# Altium schematic sheet Top.SchDoc
size Tabloid
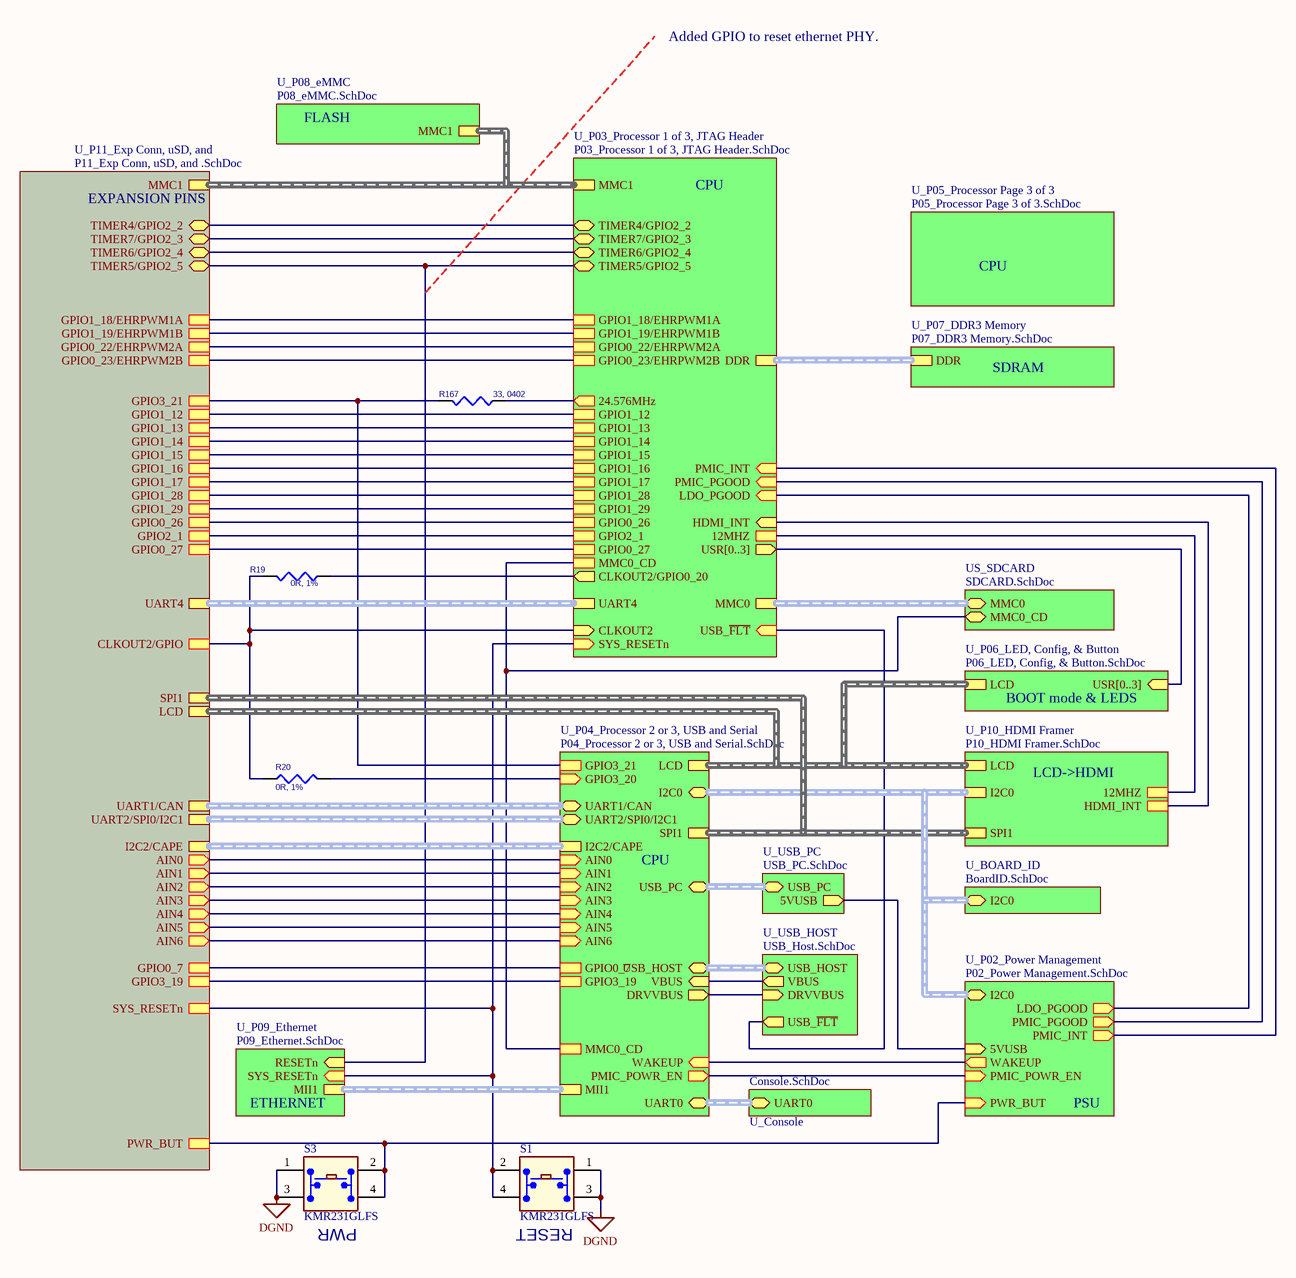
[diagram p0: Top.SchDoc]

## Parts
R19  0R, 1%  [402]
R20  0R, 1%  [402]
R167  33, 0402  [402]
S1  KMR231GLFS  [SW4SMD_63X161LS]
S3  KMR231GLFS  [SW4SMD_63X161LS]

## Sub-sheets
Console.SchDoc = U_Console: UART0 (harness UART)
U_BOARD_ID = BoardID.SchDoc: I2C0 (harness I2C)
U_P02_Power Management = P02_Power Management.SchDoc: PMIC_PGOOD (out), LDO_PGOOD (out), WAKEUP (out), PMIC_INT (out), PMIC_POWR_EN (in), PWR_BUT (in), I2C0 (harness I2C), 5VUSB (in)
U_P03_Processor 1 of 3, JTAG Header = P03_Processor 1 of 3, JTAG Header.SchDoc: GPIO2_1, GPIO1_29, GPIO1_28, GPIO0_22/EHRPWM2A, GPIO0_23/EHRPWM2B, GPIO0_26, GPIO0_27, GPIO1_12, GPIO1_13, GPIO1_14, GPIO1_15, GPIO1_17, GPIO1_18/EHRPWM1A, GPIO1_19/EHRPWM1B, USB_~{FLT} (in), SYS_RESETn (in), PMIC_INT (in), 12MHZ, GPIO1_16, 24.576MHz (out), LDO_PGOOD (in), PMIC_PGOOD (in), MMC0_CD, HDMI_INT (in), USR[0..3] (out), MMC1 (harness MMC1), MMC0 (harness MMC0), UART4 (harness UART), DDR (harness DDR), CLKOUT2/GPIO0_20 (out), CLKOUT2 (in), TIMER5/GPIO2_5 (bidir), TIMER4/GPIO2_2 (bidir), TIMER7/GPIO2_3 (bidir), TIMER6/GPIO2_4 (bidir)
U_P04_Processor 2 or 3, USB and Serial = P04_Processor 2 or 3, USB and Serial.SchDoc: GPIO3_21, GPIO3_19, GPIO3_20 (in), PMIC_POWR_EN (out), WAKEUP (in), AIN0 (in), AIN1 (in), AIN2 (in), AIN3 (in), AIN4 (in), AIN5 (in), AIN6 (in), MMC0_CD, GPIO0_7, LCD (harness LCD), SPI1 (harness SPI), I2C2/CAPE (harness I2C), MII1 (harness MII), I2C0 (harness I2C), UART0 (harness UART), UART1/CAN (harness UART/CAN), UART2/SPI0/I2C1 (harness UART/SPI/I2C1), USB_PC (harness USB_PC), USB_HOST (harness USB_PC), VBUS (in), DRVVBUS (out)
U_P05_Processor Page 3 of 3 = P05_Processor Page 3 of 3.SchDoc: no entries
U_P06_LED, Config, & Button = P06_LED, Config, & Button.SchDoc: USR[0..3] (in), LCD (harness LCD)
U_P07_DDR3 Memory = P07_DDR3 Memory.SchDoc: DDR (harness DDR)
U_P08_eMMC = P08_eMMC.SchDoc: MMC1 (harness MMC1)
U_P09_Ethernet = P09_Ethernet.SchDoc: MII1 (harness MII), RESETn (in), SYS_RESETn (in)
U_P10_HDMI Framer = P10_HDMI Framer.SchDoc: HDMI_INT, 12MHZ, I2C0 (harness I2C), LCD (harness LCD), SPI1 (harness SPI)
U_P11_Exp Conn, uSD, and = P11_Exp Conn, uSD, and .SchDoc: GPIO1_13, GPIO0_23/EHRPWM2B, GPIO1_15, GPIO0_27, GPIO0_22/EHRPWM2A, GPIO1_12, GPIO0_26, GPIO1_14, GPIO2_1, GPIO1_29, PWR_BUT, GPIO1_16, GPIO1_17, GPIO3_21, GPIO3_19, AIN4 (out), AIN6 (out), AIN2 (out), AIN0 (out), CLKOUT2/GPIO, SYS_RESETn, GPIO1_28, GPIO1_18/EHRPWM1A, GPIO1_19/EHRPWM1B, AIN5 (out), AIN3 (out), AIN1 (out), GPIO0_7, LCD (harness LCD), MMC1 (harness MMC1), UART4 (harness UART), I2C2/CAPE (harness I2C), UART2/SPI0/I2C1 (harness UART/SPI/I2C1), UART1/CAN (harness UART/CAN), SPI1 (harness SPI), TIMER5/GPIO2_5 (bidir), TIMER7/GPIO2_3 (bidir), TIMER6/GPIO2_4 (bidir), TIMER4/GPIO2_2 (bidir)
U_USB_HOST = USB_Host.SchDoc: USB_HOST (harness USB_PC), USB_~{FLT} (out), VBUS (out), DRVVBUS (in)
U_USB_PC = USB_PC.SchDoc: USB_PC (harness USB_PC), 5VUSB (out)
US_SDCARD = SDCARD.SchDoc: MMC0 (harness MMC0), MMC0_CD

## Nets
DGND: S1.1(A1) S1.3(A3) S3.1(A1) S3.3(A3)
NetR19_1: R19.1 ; sheet U_P03_Processor 1 of 3, JTAG Header/CLKOUT2/GPIO0_20
NetR19_2: R19.2 R20.1 ; sheet U_P03_Processor 1 of 3, JTAG Header/CLKOUT2, sheet U_P11_Exp Conn, uSD, and/CLKOUT2/GPIO
NetR20_2: R20.2 ; sheet U_P04_Processor 2 or 3, USB and Serial/GPIO3_20
NetR167_1: R167.1 ; sheet U_P03_Processor 1 of 3, JTAG Header/24.576MHz
NetR167_2: R167.2 ; sheet U_P04_Processor 2 or 3, USB and Serial/GPIO3_21, sheet U_P11_Exp Conn, uSD, and/GPIO3_21
NetS1_2: S1.2(A2) S1.4 ; sheet U_P03_Processor 1 of 3, JTAG Header/SYS_RESETn, sheet U_P09_Ethernet/SYS_RESETn, sheet U_P11_Exp Conn, uSD, and/SYS_RESETn
NetS3_2: S3.2(A2) S3.4 ; sheet U_P02_Power Management/PWR_BUT, sheet U_P11_Exp Conn, uSD, and/PWR_BUT
(unnamed): sheet U_P02_Power Management/PMIC_PGOOD, sheet U_P03_Processor 1 of 3, JTAG Header/PMIC_PGOOD
(unnamed): sheet U_P02_Power Management/LDO_PGOOD, sheet U_P03_Processor 1 of 3, JTAG Header/LDO_PGOOD
(unnamed): sheet U_P02_Power Management/WAKEUP, sheet U_P04_Processor 2 or 3, USB and Serial/WAKEUP
(unnamed): sheet U_P02_Power Management/PMIC_INT, sheet U_P03_Processor 1 of 3, JTAG Header/PMIC_INT
(unnamed): sheet U_P02_Power Management/PMIC_POWR_EN, sheet U_P04_Processor 2 or 3, USB and Serial/PMIC_POWR_EN
(unnamed): sheet U_P02_Power Management/5VUSB, sheet U_USB_PC/5VUSB
(unnamed): sheet U_P10_HDMI Framer/HDMI_INT, sheet U_P03_Processor 1 of 3, JTAG Header/HDMI_INT
(unnamed): sheet U_P10_HDMI Framer/12MHZ, sheet U_P03_Processor 1 of 3, JTAG Header/12MHZ
(unnamed): sheet U_P04_Processor 2 or 3, USB and Serial/GPIO3_19, sheet U_P11_Exp Conn, uSD, and/GPIO3_19
(unnamed): sheet U_P04_Processor 2 or 3, USB and Serial/AIN0, sheet U_P11_Exp Conn, uSD, and/AIN0
(unnamed): sheet U_P04_Processor 2 or 3, USB and Serial/AIN1, sheet U_P11_Exp Conn, uSD, and/AIN1
(unnamed): sheet U_P04_Processor 2 or 3, USB and Serial/AIN2, sheet U_P11_Exp Conn, uSD, and/AIN2
(unnamed): sheet U_P04_Processor 2 or 3, USB and Serial/AIN3, sheet U_P11_Exp Conn, uSD, and/AIN3
(unnamed): sheet U_P04_Processor 2 or 3, USB and Serial/AIN4, sheet U_P11_Exp Conn, uSD, and/AIN4
(unnamed): sheet U_P04_Processor 2 or 3, USB and Serial/AIN5, sheet U_P11_Exp Conn, uSD, and/AIN5
(unnamed): sheet U_P04_Processor 2 or 3, USB and Serial/AIN6, sheet U_P11_Exp Conn, uSD, and/AIN6
(unnamed): sheet U_P04_Processor 2 or 3, USB and Serial/MMC0_CD, sheet U_P03_Processor 1 of 3, JTAG Header/MMC0_CD, sheet US_SDCARD/MMC0_CD
(unnamed): sheet U_P04_Processor 2 or 3, USB and Serial/GPIO0_7, sheet U_P11_Exp Conn, uSD, and/GPIO0_7
(unnamed): sheet U_P04_Processor 2 or 3, USB and Serial/VBUS, sheet U_USB_HOST/VBUS
(unnamed): sheet U_P04_Processor 2 or 3, USB and Serial/DRVVBUS, sheet U_USB_HOST/DRVVBUS
(unnamed): sheet U_P03_Processor 1 of 3, JTAG Header/GPIO2_1, sheet U_P11_Exp Conn, uSD, and/GPIO2_1
(unnamed): sheet U_P03_Processor 1 of 3, JTAG Header/GPIO1_29, sheet U_P11_Exp Conn, uSD, and/GPIO1_29
(unnamed): sheet U_P03_Processor 1 of 3, JTAG Header/GPIO1_28, sheet U_P11_Exp Conn, uSD, and/GPIO1_28
(unnamed): sheet U_P03_Processor 1 of 3, JTAG Header/GPIO0_22/EHRPWM2A, sheet U_P11_Exp Conn, uSD, and/GPIO0_22/EHRPWM2A
(unnamed): sheet U_P03_Processor 1 of 3, JTAG Header/GPIO0_23/EHRPWM2B, sheet U_P11_Exp Conn, uSD, and/GPIO0_23/EHRPWM2B
(unnamed): sheet U_P03_Processor 1 of 3, JTAG Header/GPIO0_26, sheet U_P11_Exp Conn, uSD, and/GPIO0_26
(unnamed): sheet U_P03_Processor 1 of 3, JTAG Header/GPIO0_27, sheet U_P11_Exp Conn, uSD, and/GPIO0_27
(unnamed): sheet U_P03_Processor 1 of 3, JTAG Header/GPIO1_12, sheet U_P11_Exp Conn, uSD, and/GPIO1_12
(unnamed): sheet U_P03_Processor 1 of 3, JTAG Header/GPIO1_13, sheet U_P11_Exp Conn, uSD, and/GPIO1_13
(unnamed): sheet U_P03_Processor 1 of 3, JTAG Header/GPIO1_14, sheet U_P11_Exp Conn, uSD, and/GPIO1_14
(unnamed): sheet U_P03_Processor 1 of 3, JTAG Header/GPIO1_15, sheet U_P11_Exp Conn, uSD, and/GPIO1_15
(unnamed): sheet U_P03_Processor 1 of 3, JTAG Header/GPIO1_17, sheet U_P11_Exp Conn, uSD, and/GPIO1_17
(unnamed): sheet U_P03_Processor 1 of 3, JTAG Header/GPIO1_18/EHRPWM1A, sheet U_P11_Exp Conn, uSD, and/GPIO1_18/EHRPWM1A
(unnamed): sheet U_P03_Processor 1 of 3, JTAG Header/GPIO1_19/EHRPWM1B, sheet U_P11_Exp Conn, uSD, and/GPIO1_19/EHRPWM1B
(unnamed): sheet U_P03_Processor 1 of 3, JTAG Header/USB_~{FLT}, sheet U_USB_HOST/USB_~{FLT}
(unnamed): sheet U_P03_Processor 1 of 3, JTAG Header/GPIO1_16, sheet U_P11_Exp Conn, uSD, and/GPIO1_16
(unnamed): sheet U_P03_Processor 1 of 3, JTAG Header/TIMER5/GPIO2_5, sheet U_P09_Ethernet/RESETn, sheet U_P11_Exp Conn, uSD, and/TIMER5/GPIO2_5
(unnamed): sheet U_P03_Processor 1 of 3, JTAG Header/TIMER4/GPIO2_2, sheet U_P11_Exp Conn, uSD, and/TIMER4/GPIO2_2
(unnamed): sheet U_P03_Processor 1 of 3, JTAG Header/TIMER7/GPIO2_3, sheet U_P11_Exp Conn, uSD, and/TIMER7/GPIO2_3
(unnamed): sheet U_P03_Processor 1 of 3, JTAG Header/TIMER6/GPIO2_4, sheet U_P11_Exp Conn, uSD, and/TIMER6/GPIO2_4

## Buses and harness runs
bus sheet U_P03_Processor 1 of 3, JTAG Header/USR[0..3] = sheet U_P06_LED, Config, & Button/USR[0..3]
harness sheet Console.SchDoc/UART0 = sheet U_P04_Processor 2 or 3, USB and Serial/UART0
harness sheet U_BOARD_ID/I2C0 = sheet U_P02_Power Management/I2C0 = sheet U_P04_Processor 2 or 3, USB and Serial/I2C0 = sheet U_P10_HDMI Framer/I2C0
harness sheet U_P03_Processor 1 of 3, JTAG Header/DDR = sheet U_P07_DDR3 Memory/DDR
harness sheet U_P03_Processor 1 of 3, JTAG Header/MMC0 = sheet US_SDCARD/MMC0
harness sheet U_P03_Processor 1 of 3, JTAG Header/MMC1 = sheet U_P08_eMMC/MMC1 = sheet U_P11_Exp Conn, uSD, and/MMC1
harness sheet U_P03_Processor 1 of 3, JTAG Header/UART4 = sheet U_P11_Exp Conn, uSD, and/UART4
harness sheet U_P04_Processor 2 or 3, USB and Serial/I2C2/CAPE = sheet U_P11_Exp Conn, uSD, and/I2C2/CAPE
harness sheet U_P04_Processor 2 or 3, USB and Serial/LCD = sheet U_P06_LED, Config, & Button/LCD = sheet U_P10_HDMI Framer/LCD = sheet U_P11_Exp Conn, uSD, and/LCD
harness sheet U_P04_Processor 2 or 3, USB and Serial/MII1 = sheet U_P09_Ethernet/MII1
harness sheet U_P04_Processor 2 or 3, USB and Serial/SPI1 = sheet U_P10_HDMI Framer/SPI1 = sheet U_P11_Exp Conn, uSD, and/SPI1
harness sheet U_P04_Processor 2 or 3, USB and Serial/UART1/CAN = sheet U_P11_Exp Conn, uSD, and/UART1/CAN
harness sheet U_P04_Processor 2 or 3, USB and Serial/UART2/SPI0/I2C1 = sheet U_P11_Exp Conn, uSD, and/UART2/SPI0/I2C1
harness sheet U_P04_Processor 2 or 3, USB and Serial/USB_HOST = sheet U_USB_HOST/USB_HOST
harness sheet U_P04_Processor 2 or 3, USB and Serial/USB_PC = sheet U_USB_PC/USB_PC

## Notes on the sheet
- Added GPIO to reset ethernet PHY.
- FLASH
- EXPANSION PINS
- CPU
- SDRAM
- BOOT mode & LEDS
- LCD->HDMI
- ETHERNET
- PSU
- (near S3) PWR
- (near S1) RESET

## Library data of the parts
R19 R20 = RES_0_1/16W_1%_0402: RES 0.0 OHM 1/16W 0402 SMD; Manufacturer: Yageo; Manufacturer Part Number: RC0402JR-070RL; Resistance (Ohms): 0.0; Power (Watts): 0.063W, 1/16W; Tolerance: Jumper; Supplier 1: Digi-Key; Supplier Part Number 1: 311-0.0JRDKR-ND; RoHS: RoHS Compliant; Category: Resistors; Stock 1: 4904429; Pricing 1: 1=0.1, 10=0.012, 25=0.0092, 100=0.0055, 250=0.00476, 500=0.00336, 1000=0.00237, 2500=0.00206, 5000=0.00178 (USD); Composition: Thick Film; Features: -; Temperature Coefficient: -; Package / Case: 0402 (1005 Metric); Supplier Device Package: 0402; Size / Dimension: 0.039" L x 0.020" W (1.00mm x 0.50mm); Height: 0.016" (0.40mm); Number of Terminations: 2; Packaging: Digi-Reel®; ComponentLink1URL: http://www.yageo.com/documents/recent/PYu-RC0402_51_RoHS_L_6.pdf; ComponentLink1Description: http://www.yageo.com/documents/recent/PYu-RC0402_51_RoHS_L_6.pdf
R167 = RES_33_0402: RES 33 OHM 1/16W 5% 0402 SMD; Manufacturer: Panasonic Electronic Components; Manufacturer Part Number: ERJ-2GEJ330X; Resistance (Ohms): 33; Power (Watts): 0.1W, 1/10W; Temperature Coefficient: ±200ppm/°C; Supplier 1: Digi-Key; Supplier Part Number 1: P33JDKR-ND; RoHS: RoHS Compliant; Category: Resistors; Stock 1: 5879945; Pricing 1: 1=0.1, 50=0.0172, 100=0.0131, 250=0.00976, 500=0.0072, 1000=0.0048, 5000=0.00338 (USD); Composition: Thick Film; Features: -; Tolerance: ±5%; Package / Case: 0402 (1005 Metric); Supplier Device Package: 0402; Size / Dimension: 0.039" L x 0.020" W (1.00mm x 0.50mm); Height: 0.016" (0.40mm); Number of Terminations: 2; Packaging: Digi-Reel®; ComponentLink1URL: http://industrial.panasonic.com/www-cgi/jvcr13pz.cgi?E+PZ+3+AOA0001+ERJ2GEJ330X+7+WW; ComponentLink1Description: http://industrial.panasonic.com/www-cgi/jvcr13pz.cgi?E+PZ+3+AOA0001+ERJ2GEJ330X+7+WW
S1 S3 = KMR2: Microminiature Tact Switch for SMT; Manufacturer: C&K Components; Circuit: SPST-NO; Switch Function: Off-Mom; Contact Rating @ Voltage: 0.05A @ 32VDC; Actuator Type: Standard; Actuator Height off PCB, from Pins: 1.90mm; Actuator Orientation: Top Actuated; Outline: 4.60mm x 2.80mm; Illumination: Non-Illuminated; Operating Force: 300gf; Switch Travel: 0.25mm; Mechanical Life: 150,000 Cycles; Supplier 1: Digi-Key; Supplier Part Number 1: 401-1429-6-ND; Manufacturer Part Number: KMR231GLFS; RoHS: RoHS Compliant; Category: Switches; Stock 1: 32289; Pricing 1: 1=0.44, 10=0.416, 25=0.3744, 50=0.3326, 100=0.3188, 250=0.29108, 500=0.2772, 1000=0.22869 (USD); Mounting Type: Surface Mount; Termination Style: Gull Wing; Illumination Voltage (Nominal): -; Illumination Type, Color: -; Ingress Protection: -; Features: Grounding Pin; Packaging: Digi-Reel®; Actuator Material: -; Operating Temperature: -40°C ~ 85°C; ComponentLink1URL: http://www.ck-components.com/index.php?module=media&action=Display&cmpref=14414&lang=en&width=&height=&format=&alt=; ComponentLink1Description: http://www.ck-components.com/index.php?module=media&action=Display&cmpref=14414&lang=en&width=&height=&format=&alt=